# EAGLE design BOOSTCONVERTER20K20 (EAGLE 9.5.0)
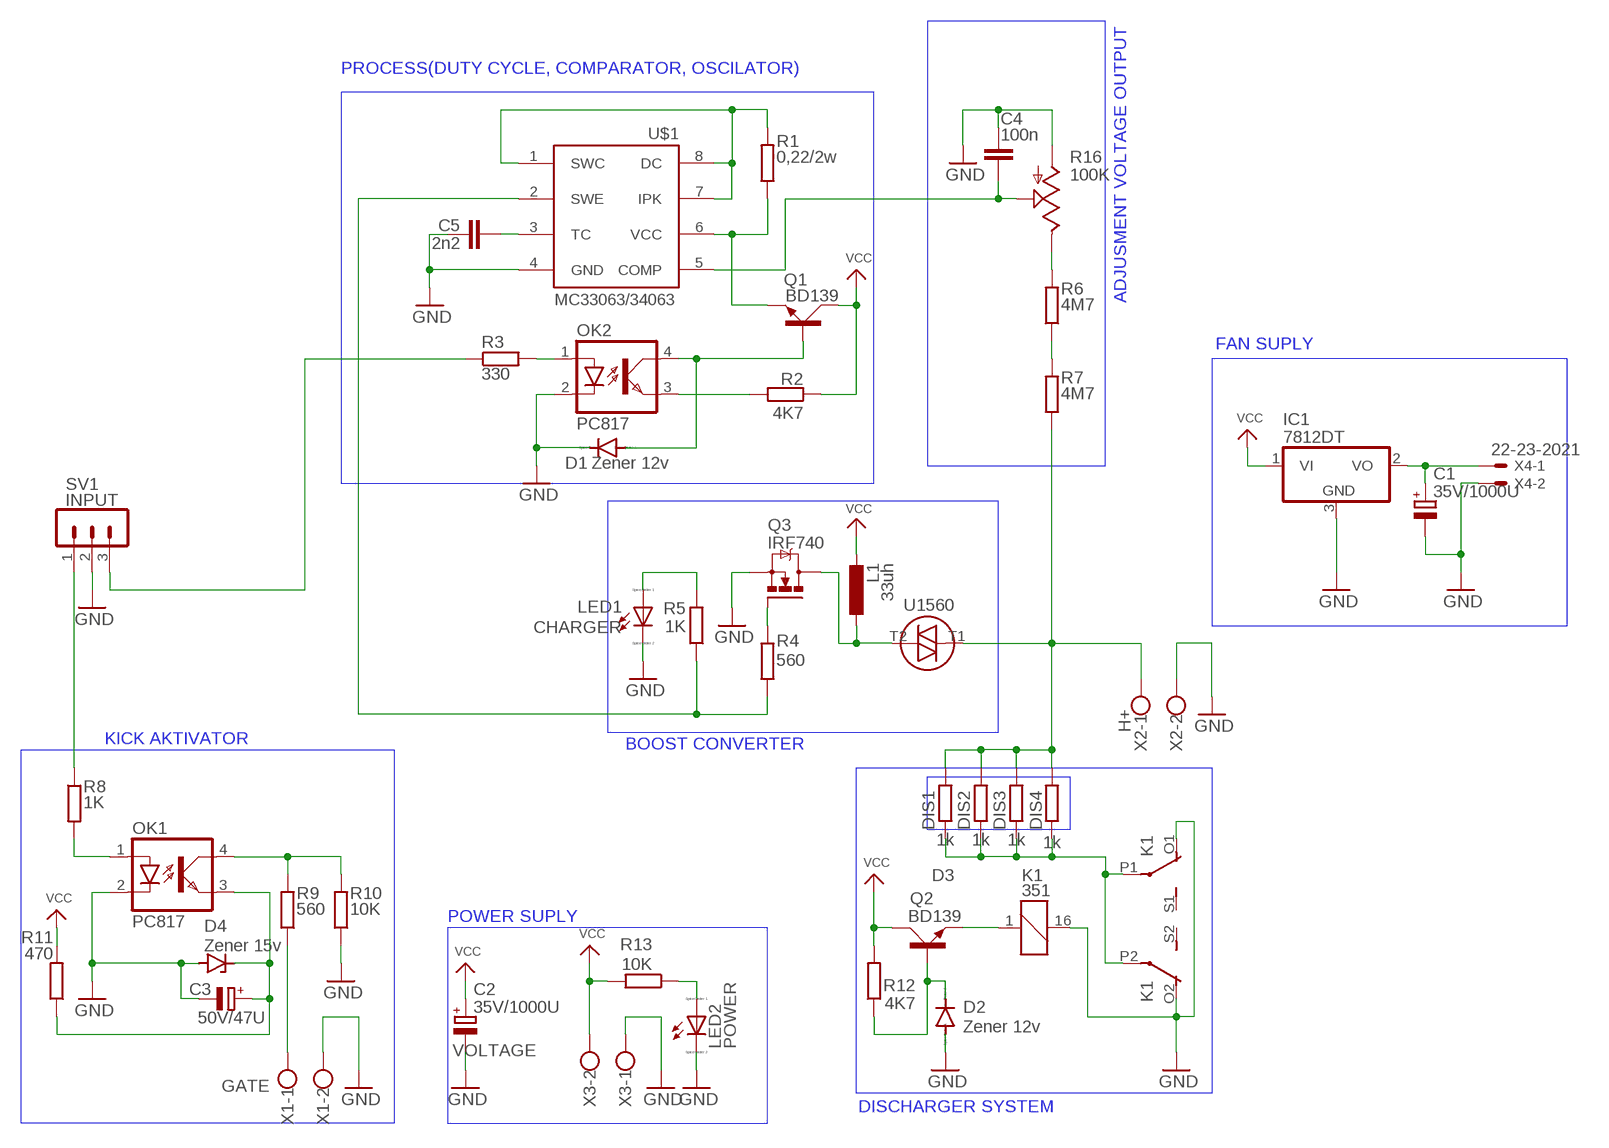
[diagram p0: schematic, sheet 1]

## Parts
C1  35V/1000U  CPOL-EUE2.5-7  [E2,5-7]
C2  35V/1000U  CPOL-EUE2.5-7  [E2,5-7]
C3  50V/47U  CPOL-EU153CLV-0810  [153CLV-0810]
C4  100n  C-EUC0805K  [C0805K]
C5  2n2  C-EUC0805K  [C0805K]
D1  Zener 12v  1N4148DO35-7  [DO35-7]
D2  Zener 12v  1N4148DO35-7  [DO35-7]
D3  U1560  BR210  [BR210S]
D4  Zener 15v  BZX55  [DO35Z10]
DIS1  1k  R-EU_VTA53  [VTA53]
DIS2  1k  R-EU_VTA53  [VTA53]
DIS3  1k  R-EU_VTA53  [VTA53]
DIS4  1k  R-EU_VTA53  [VTA53]
IC1  7812DT  [TO252]
K1  351  [351]
L1  33uh  L-EUTJ3-U2  [TJ3-U2]
LED1  CHARGER  LED_E  [LED_1206]
LED2  POWER  LED_E  [LED_1206]
OK1  PC817  [DIL04]
OK2  PC817  [DIL04]
Q1  BD139  [TO126AV]
Q2  BD139  [TO126AV]
Q3  IRF740  [TO220BV]
R1  0,22/2w  R-EU_M1206  [M1206]
R2  4K7  R-EU_M1206  [M1206]
R3  330  R-EU_M1206  [M1206]
R4  560  R-EU_M1206  [M1206]
R5  1K  R-EU_M1206  [M1206]
R6  4M7  R-EU_0309/10  [0309/10]
R7  4M7  R-EU_0309/10  [0309/10]
R8  1K  R-EU_M1206  [M1206]
R9  560  R-EU_M1206  [M1206]
R10  10K  R-EU_M1206  [M1206]
R11  470  R-EU_M1206  [M1206]
R12  4K7  R-EU_M1206  [M1206]
R13  10K  R-EU_M1206  [M1206]
R16  100K  TRIM_US-CA6V  [CA6V]
SV1  INPUT  MA03-1  [MA03-1]
U$1  MC33063/MC34063D  [SO08]
X1  GATE  W237-102  [W237-102]
X2  H+  W237-102  [W237-102]
X3  VOLTAGE  W237-102  [W237-102]
X4  22-23-2021  [22-23-2021]

## Nets
GND: C1.- C2.- C3.- C4.1 C5.1 D1.C D2.A D4.A IC1.3(GND) K1.16 K1.O1(2:O) K1.O2(3:O) LED1.C LED2.C OK1.2(C) OK2.2(C) Q3.S R10.1 R16.A SV1.2 U$1.4(GND) X1.2 X2.2 X3.1 X4.2
N$1: R1.2 U$1.1(SWC) U$1.7(IPK) U$1.8(DC)
N$2: Q1.E R1.1 U$1.6(VCC)
N$3: D1.A OK2.4(COL) Q1.B
N$4: OK2.3(EMIT) R2.2
N$5: R8.1 SV1.1
N$6: OK2.1(A) R3.2
N$7: D3.T2 L1.1 Q3.D
N$8: C4.2 R16.S U$1.5(COMP)
N$9: K1.1 Q2.E
N$10: C5.2 U$1.3(TC)
N$11: LED1.A R5.2
N$12: R6.1 R7.2
N$13: Q3.G R4.1
N$14: R3.1 SV1.3
N$15: R6.2 R16.E
N$16: DIS1.1 DIS2.1 DIS3.1 DIS4.1 K1.P1(2:P) K1.P2(3:P)
N$17: OK1.1(A) R8.2
N$18: OK1.4(COL) R9.2 R10.2
N$21: C3.+ D4.C OK1.3(EMIT) R11.1
N$22: D2.C Q2.B R12.1
N$23: R9.1 X1.1
N$24: LED2.A R13.1
N$25: R4.2 R5.1 U$1.2(SWE)
N$27: D3.T1 DIS1.2 DIS2.2 DIS3.2 DIS4.2 R7.1 X2.1
N$38: C1.+ IC1.2(VO) X4.1
VCC: C2.+ IC1.1(VI) L1.2 Q1.C Q2.C R2.1 R11.2 R12.2 R13.2 X3.2
Unconnected: K1.S1(2:S) K1.S2(3:S)

## Notes on the sheet
- ADJUSMENT VOLTAGE OUTPUT
- PROCESS(DUTY CYCLE, COMPARATOR, OSCILATOR)
- FAN SUPLY
- KICK AKTIVATOR
- BOOST CONVERTER
- POWER SUPLY
- DISCHARGER SYSTEM

## Library data of the parts
C1-C3 = rcl:CPOL-EU: POLARIZED CAPACITOR, European symbol; SPICEPREFIX: C
C4 C5 = rcl:C-EU: CAPACITOR, European symbol; SPICEPREFIX: C
D1 D2 = diode:1N4148: DIODE high speed (Philips)
D3 = diode:BR210: DIAC
D4 = diode:BZX55: Z DIODE
DIS1-DIS4 R1-R13 = rcl:R-EU_: RESISTOR, European symbol; SPICEPREFIX: R
IC1 = adafruit:78*: Positive VOLTAGE REGULATOR Added bigger pads to the TO-92 package
K1 = relay:351: RELAY 2 x switch, Omron; OC_FARNELL: unknown; OC_NEWARK: unknown
L1 = rcl:L-EU: INDUCTOR, European symbol; SPICEPREFIX: L
LED1 LED2 = eagle-ltspice:LED_E: LED Source: http://www.osram.convergy.de Source: www.luxeon.com Source: www.kingbright.com; SPICEMODEL: NONE; SPICEPREFIX: D; SPICETYPE: diode
OK1 OK2 = optocoupler:PC817: SHARP OPTO COUPLER; MPN: PC817X4J000F; OC_FARNELL: 9707727; OC_NEWARK: 97K7059
Q1 Q2 = transistor-power:BD139: NPN TRANSISTOR
Q3 = transistor-power:IRF740: N-CHANNEL MOS FET
R16 = pot:TRIM_US-: POTENTIOMETER
SV1 = con-lstb:MA03-1: PIN HEADER; OC_FARNELL: unknown; OC_NEWARK: unknown
U$1 = adafruit:MC33063/MC34063: MC33063 and MC34063 Basic DC/DC converter with internal power-NPN transistor, 100KHz, 1.5A peak switch current. 3-40 input/output.
X1-X3 = con-wago-500:W237-102: WAGO SCREW CLAMP; MPN: 237-102; OC_FARNELL: unknown; OC_NEWARK: 70K9898
X4 = con-molex:22-23-2021: .100" (2.54mm) Center Header - 2 Pin; MF: MOLEX; MPN: 22-23-2021; OC_FARNELL: 1462926; OC_NEWARK: 25C3832

## Board
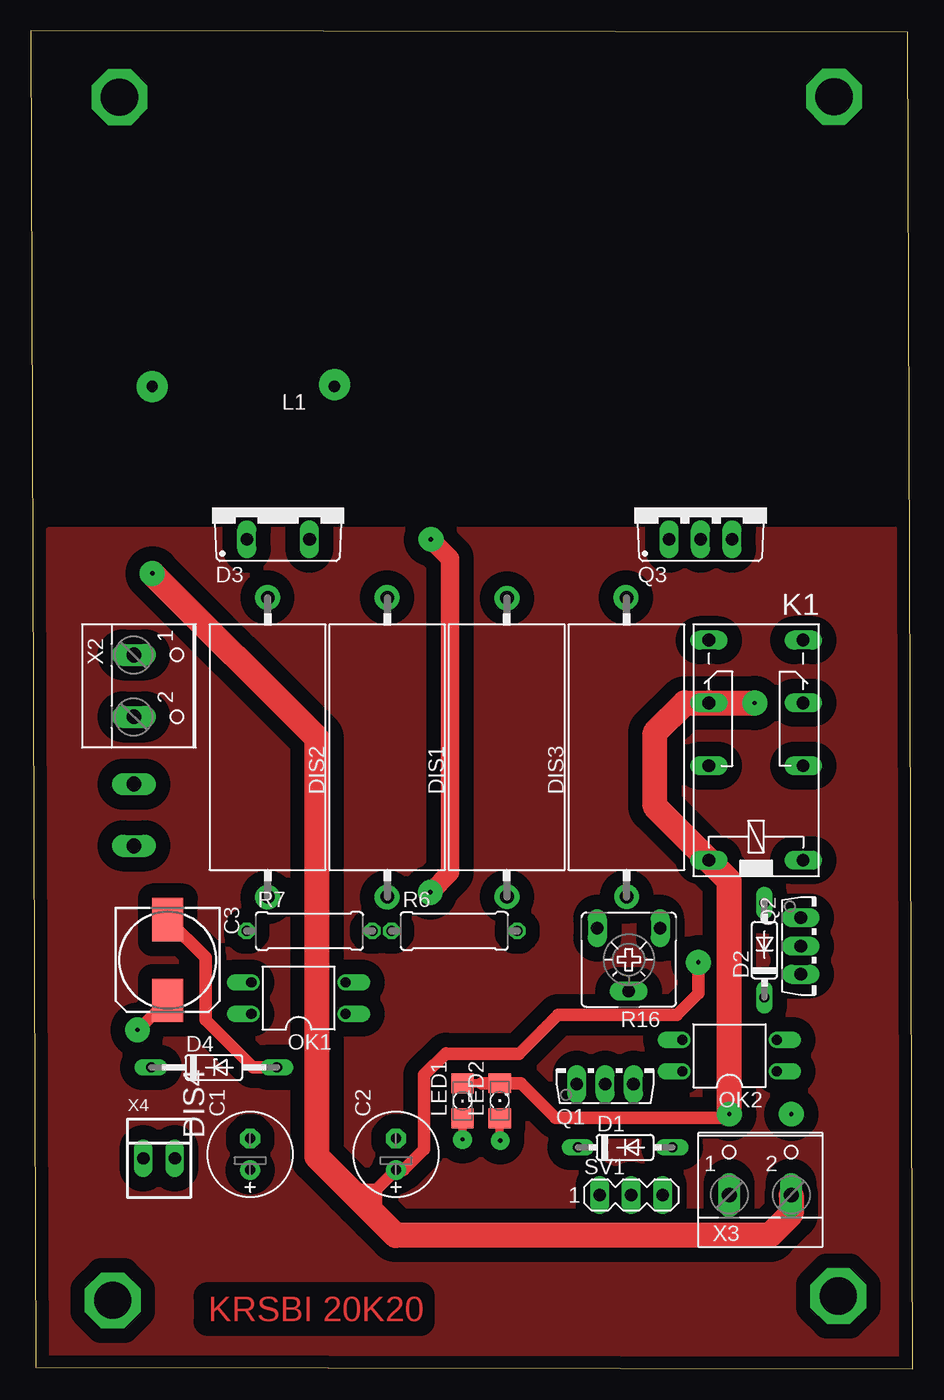
[diagram p1: board, top side]
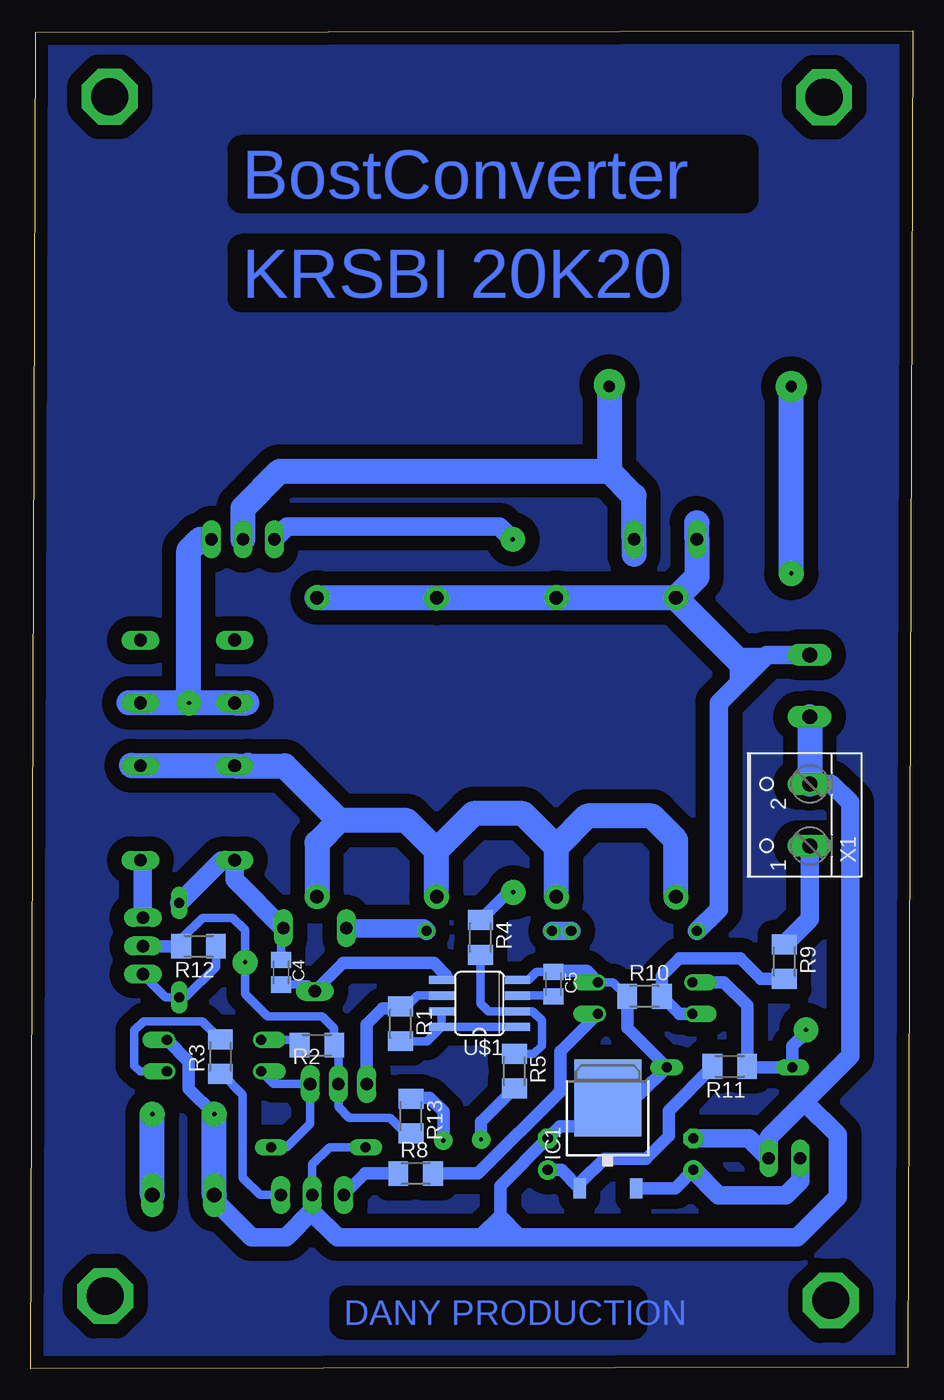
[diagram p2: board, bottom side, seen from below]

Size 71.2 x 108 mm. Coordinates in mm from the lower left corner, seen from the top.
Outline: 0.4,0.1 71.2,0 70.8,107.9 0,108 0.4,0.1
Copper layers (1*16): Top 0.035mm / dielectric 1.5mm / Bottom 0.035mm
Design rules "default *": minimum track width 6mil, minimum drill 0.35mm, track to track 46mil, track to pad 46mil, pad to pad 6mil, via to via 6mil, smd to smd 46mil, copper to edge 40mil, drill to drill 6mil, minimum pad ring 10mil, minimum via ring 8mil, stop-mask expansion 4mil, vias tented up to drill 0mil, thermal gap 0mil

### Footprints (pad centres in the part's own frame; a part is rotated, then mirrored left to right if it is on the bottom)
E2,5-7 = drill 0.813 pad 1.6: + -1.27,0 | drill 0.813 pad 1.6 octagon: - 1.27,0
153CLV-0810 = smd 3.5 x 2.5: + 3.25,0; - -3.25,0
C0805K = smd 1.3 x 1.6: 1 -1,0; 2 1,0
DO35-7 = drill 0.813 long: A 3.81,0; C -3.81,0
BR210S = drill 1.016 long: T1 -2.54,-2.54; T2 2.54,-2.54
DO35Z10 = drill 0.813 long: A 5.08,0; C -5.08,0
VTA53 = drill 1.1 octagon: 1 -12.065,0; 2 12.065,0
TO252 = smd 1 x 1.6: 1 -2.28,-4.8; 2 2.28,-4.8 | smd 5.4 x 6.2: 3 0,2.5
351 = drill 1.016 long: 1 -3.81,-3.81; 16 -3.81,3.81; O1 8.89,-3.81; O2 8.89,3.81; P1 3.81,-3.81; P2 3.81,3.81; S1 13.97,-3.81; S2 13.97,3.81
TJ3-U2 = drill 0.9: 1 -7.35,0; 2 7.35,0
LED_1206 = smd 1.6 x 1.803: A -1.422,0; C 1.422,0
DIL04 = drill 0.813 offset: 1 -1.27,-3.81; 2 1.27,-3.81; 3 1.27,3.81; 4 -1.27,3.81
TO126AV = drill 1.016 long: B 2.286,-1.27; C 0,-1.27; E -2.286,-1.27
TO220BV = drill 1.016 long: D 0,-2.54; G -2.54,-2.54; S 2.54,-2.54
M1206 = smd 1.6 x 2: 1 -1.4,0; 2 1.4,0
0309/10 = drill 0.813 octagon: 1 -5.08,0; 2 5.08,0
CA6V = drill 1.016 long: A -2.54,-2.54; E 2.54,-2.54; S 0,2.54
MA03-1 = drill 1.016 long: 1 -2.54,0; 2 0,0; 3 2.54,0
SO08 = smd 0.66 x 2.032: 1 -1.905,-3.073; 2 -0.635,-3.073; 3 0.635,-3.073; 4 1.905,-3.073; 5 1.905,3.073; 6 0.635,3.073; 7 -0.635,3.073; 8 -1.905,3.073
W237-102 = drill 1.194 long: 1 -2.5,-1.27; 2 2.5,-1.27
22-23-2021 = drill 1 long: 1 -1.27,0; 2 1.27,0

### Placement (x,y rotation side)
C1  17.7,17.3 90 top
C2  29.47,17.3 90 top
C3  11.05,32.98 270 top
C4  51,32 270 bottom
C5  29,31.04 270 bottom
D1  47.98,17.86 0 top
D2  59.24,33.78 90 top
D3  19.96,69.51 0 top
D4  14.78,24.31 0 top
DIS1  38.44,50.16 90 top
DIS2  28.78,50.16 90 top
DIS3  48.1,50.16 90 top
DIS4  19.12,50.16 90 top
IC1  24.62,19.36 0 bottom
K1  58.56,44.85 90 top
L1  17.15,79.31 180 top
LED1  34.85,21.61 90 top
LED2  37.85,21.62 90 top
OK1  21.61,29.92 90 top
OK2  56.41,25.26 90 top
Q1  46.37,24.24 0 top
Q2  63.44,34.12 270 top
Q3  54.08,69.51 0 top
R1  41.35,27.83 270 bottom
R2  48.1,26.11 180 bottom
R3  55.9,25.18 90 bottom
R4  34.9,34.81 270 bottom
R5  32.15,24.01 270 bottom
R6  34.19,35.33 0 top
R7  22.49,35.33 0 top
R8  40.13,15.75 0 bottom
R9  10.35,32.85 270 bottom
R10  21.65,30.05 0 bottom
R11  14.76,24.4 180 bottom
R12  57.66,34.1 180 bottom
R13  40.5,20.38 270 bottom
R16  48.28,33.01 180 top
SV1  48.48,14.01 0 top
U$1  34.98,29.48 90 bottom
X1  9.58,44.7 90 bottom
X2  9.58,55.12 270 top
X3  58.9,15.28 0 top
X4  10.35,16.97 0 top

### Tracks (layer width: path | path; a pad name or v marks a point on that pad's centre or on a via)
GND  (via drill 0.35 pad 2)
  Top 0.7: LED1.C 36.4,23.03 LED2.C
  Top 1: 36.4,23.03 39.57,23.03 42.35,20.25 56.1,20.25 v56.4,20.55 | C3.- 14.1,33.18 14.1,28.15 17.94,24.31 D4.A
  Top 2: v56.4,20.55 56.4,39.39 K1.16 50.4,45.39 50.4,51.35 52.79,53.74 K1.O2 v58.45,53.74
  Bottom 0.7: U$1.4 31.02,31.39 30.36,32.04 C5.1 28.95,32.09 | D1.C 47.09,17.86 48.48,16.47 SV1.2 | 26.02,19.57 24.62,20.98 | 23.75,19.2 24.62,20.07 24.62,20.98 | 24.62,20.98 24.62,22.16 | OK1.2 24.19,31.19 R10.1 | C4.1 51,35.37 R16.A
  Bottom 1: 26.02,19.57 28.46,19.57 C2.- 33.3,14.74 33.3,12.4 | 24.62,22.16 22.01,22.16 D4.A 23.05,27.5 R10.1 | 48.48,12.63 48.48,12.72 SV1.2 | OK2.2 58.45,24.76 58.45,22.6 v56.4,20.55 | 33.3,12.4 33.3,10.6 | 33.3,12.4 31.7,10.8 31.7,10.6 | 33.3,12.4 35,10.7 35,10.6 | IC1.3 24.62,20.98 | OK1.2 26.32,32.09 28.95,32.09
  Bottom 1.5: X1.2 6.55,47.2 5.05,45.7 5.05,25.25 8.75,21.55 | 8.75,21.55 11.62,18.68 X4.2 13.22,18.57 C1.- | D2.A 55.79,41.04 K1.16 54.75,39.48 R16.A | X3.1 56.4,13.61 53.39,10.6 50.6,10.6 48.48,12.72 | 48.48,12.63 46.45,10.6 35,10.6 33.3,10.6 31.7,10.6 9.3,10.6 6.05,13.85 6.05,18.85 8.75,21.55 | Q3.S 57.53,66.97
  Bottom 2: 63.3,53.75 63.29,53.74 K1.O1 v58.45,53.74 58.45,66.05 57.53,66.97 | 53.75,53.75 53.76,53.74 K1.O2 57.79,53.74 57.95,53.9 | X2.2 X1.2 | X3.1 v56.4,20.55
N$1
  Bottom 0.7: U$1.8 U$1.7 | U$1.8 U$1.1 | R1.2 39.2,26.43 U$1.8
N$2
  Bottom 0.7: U$1.6 39.98,30.11 40.87,29.23 R1.1 41.67,29.23 42,28.9
  Bottom 1: 42,28.9 42.2,29.1 42.79,29.1 44.08,27.8 Q1.E
N$3
  Bottom 0.7: OK2.4 51.6,22.99 48.63,22.99 48.65,22.97 Q1.B 48.66,19.74 50.54,17.86 D1.A
N$4
  Bottom 0.7: R2.2 49.93,26.53 OK2.3
N$5
  Bottom 1: SV1.1 44.2,15.75 R8.1
N$6
  Bottom 0.7: OK2.1 62.39,23.99 62.85,24.45 62.85,27.3 62.1,28.05 57.37,28.05 R3.2
N$7
  Bottom 2: 24.5,72.45 22.5,70.45 D3.T2 22.5,65.75 | 24.5,72.45 42.05,72.45 43.3,72.45 51.1,72.45 54.08,69.47 Q3.D | L1.1 24.5,72.45
N$8
  Bottom 0.7: 37.68,31.76 U$1.5 | R16.S 48.81,31 C4.2
  Bottom 1: R16.S 46.01,32.73 38.65,32.73 37.68,31.76
N$9
  Bottom 0.7: 62.17,40.84 K1.1
  Bottom 1.5: Q2.E 62.17,40.84
N$10
  Bottom 0.7: U$1.3 29.07,30.11 C5.2
N$11  (via drill 0.35 pad 1.5)
  Top 0.7: LED1.A v34.85,18.5
  Bottom 1: v34.85,18.5 34.85,19.91 R5.2
N$12
  Bottom 1.5: R7.2 R6.1
N$13  (via drill 0.35 pad 2)
  Top 1.5: v32.3,66.95 33.85,65.4 33.85,40.05 v32.25,38.45
  Bottom 1: R4.1 32.76,38.35 32.35,38.35 v32.25,38.45
  Bottom 1.5: 32.92,67.57 v32.3,66.95 33.35,68 50.51,68 Q3.G
N$14
  Bottom 0.7: R3.1 55.78,23.78 54.1,22.1 54.1,15.4 52.71,14.01 SV1.3
N$15
  Bottom 1.5: R6.2 39.49,35.55 R16.E
N$16  (via drill 0.6 pad 2)
  Bottom 2: K1.P2 K1.P1 63.06,48.66 63.1,48.7 | K1.P2 53.74,48.66 53.7,48.7 | DIS1.1 38.44,41.84 | 38.44,41.84 40.85,44.25 46.3,44.25 | 46.3,44.25 48.1,42.45 DIS3.1 | DIS4.1 19.12,42.67 21.05,44.6 26.3,44.6 28.78,42.12 | DIS2.1 28.78,42.12 | 28.78,42.12 31.46,44.8 35.48,44.8 38.44,41.84 | K1.P2 50.71,48.66 46.3,44.25
  other vias: 48.1,38.1
N$17
  Bottom 1: R8.2 35.1,15.75 28.45,22.4 28.45,25.6 25.42,28.63 OK1.1
N$18
  Bottom 0.7: 10.9,31.45 R9.2
  Bottom 1: 10.9,31.45 12.25,31.45 13.9,33.1 18.85,33.1 20.25,31.7 R10.2 18.85,28.65 OK1.4
N$19  (via drill 0.35 pad 2)
  other vias: 24.5,79.4
N$20  (via drill 3 pad 4.5)
  other vias: 6.6,5.5
N$21  (via drill 0.35 pad 2)
  Top 1: C3.+ 8.67,27.35 v8.6,27.35
  Bottom 0.7: 13.27,24.31 R11.1
  Bottom 1: v8.6,27.35 8.6,27.16 9.7,26.06 D4.C 13.27,24.31 | R11.1 13.36,29.31 15.24,31.19 OK1.3
N$22
  Bottom 0.7: R12.1 56.26,32.44 58.73,29.97 D2.C 60.31,29.97 Q2.B
N$23
  Bottom 0.7: 10.1,34.5 R9.1
  Bottom 1.5: X1.1 8.31,36.29 10.1,34.5
N$24  (via drill 0.35 pad 1.5)
  Top 0.7: LED2.A 37.85,18.45 v37.9,18.4
  Bottom 0.7: 40.43,21.85 R13.1
  Bottom 1: v37.9,18.4 37.9,20.75 39,21.85 40.43,21.85
N$25
  Bottom 0.7: R5.1 30.6,25.41 29.95,26.06 29.95,28.1 30.7,28.85 U$1.2 34.24,28.85 34.9,29.5 R4.2
N$26  (via drill 3 pad 4.5)
  other vias: 65.2,5.85
N$27
  Bottom 1: 13.65,56.9 13.4,56.9 12.95,56.45 | 14.27,55.12 14.27,57.38 14.52,57.63 | 12.15,57.25 13.45,57.25 13.8,56.9 13.8,57.7 11.86,57.7 11.78,57.62
  Bottom 1.5: R7.1 15.65,37.09 15.65,53.75 14.27,55.12 12.95,56.45 12.15,57.25 11.78,57.62 X2.1
  Bottom 2: DIS4.2 DIS2.2 DIS1.2 DIS3.2 | DIS4.2 17.42,63.92 D3.T1 17.42,68.27 17.45,68.3 | DIS4.2 14.52,57.63 13.8,56.9 13.65,56.9
N$28  (via drill 3 pad 4.5)
  other vias: 64.85,102.7
N$29  (via drill 3 pad 4.5)
  other vias: 7.15,102.65
N$30  (via drill 0.6 pad 2)
  other vias: 19.1,62.25
N$31  (via drill 0.6 pad 2)
  other vias: 28.75,62.25
N$32  (via drill 0.6 pad 2)
  other vias: 38.45,62.2
N$33  (via drill 0.6 pad 2)
  other vias: 48.05,62.25
N$34  (via drill 0.6 pad 2)
  other vias: 38.45,38.1
N$35  (via drill 0.6 pad 2)
  other vias: 28.75,38.05
N$36  (via drill 0.6 pad 2)
  other vias: 19.1,38.05
N$37  (via drill 0.35 pad 2.5)
  other vias: 24.5,79.45
N$38
  Bottom 1: C1.+ 19.17,14.56 IC1.2
  Bottom 1.5: X4.1 9.08,15.17 10.25,14 15.67,14 C1.+
P
  pour Top: 1.4,1.1 69.9,1.1 69.9,67.7 1.4,67.7
S
  pour Bottom: 1.3,1.15 70.2,1.15 70.2,106.9 1.3,106.9
VCC  (via drill 0.35 pad 2, 0.35 pad 2.5)
  Top 1: 27.88,14.43 C2.+ 30.08,16.03 31.75,17.7 31.75,23.7 33.5,25.45 33.55,25.4 39.4,25.4 42.55,28.55 52.15,28.55 53.9,30.3 v53.9,32.8 | 27.88,14.43 26.96,13.52 26.67,13.52 | 27.88,12.32 27.88,14.43 | 27.88,14.43 25.78,14.43 25.77,14.43
  Top 2: v9.8,64.2 23.1,50.9 23.1,17.1 25.77,14.43 26.67,13.52 27.88,12.32 29.45,10.75 59.65,10.75 61.4,12.5 X3.2
  Bottom 0.7: 62.15,34.1 Q2.C | R13.2 40.6,18.88 40.83,18.88 42.2,20.25 45.5,20.25 46.37,21.12 Q1.C 46.37,25.78 R2.1 46.7,27.45 47.7,28.45 52.1,28.45 53.9,30.25 v53.9,32.8 53.9,35.4 54.9,36.4 57.35,36.4 59.06,34.69 R12.2 | 28.37,16.03 27.09,14.75 | 27.09,14.75 IC1.1 | 26.77,15.07 27.09,14.75 | 29.52,15.97 C2.+
  Bottom 1: R11.2 16.16,24.35 19.7,20.81 19.7,18.8 21.55,16.95 24.9,16.95 26.77,15.07 | IC1.1 28.37,16.03 C2.+ | R12.2 62.15,34.1
  Bottom 2: X3.2 v61.4,20.55 | v9.8,64.2 v9.8,79.3 L1.2

### Text on the board
Top: KRSBI 20K20
Bottom: BostConverter | KRSBI 20K20 | DANY PRODUCTION